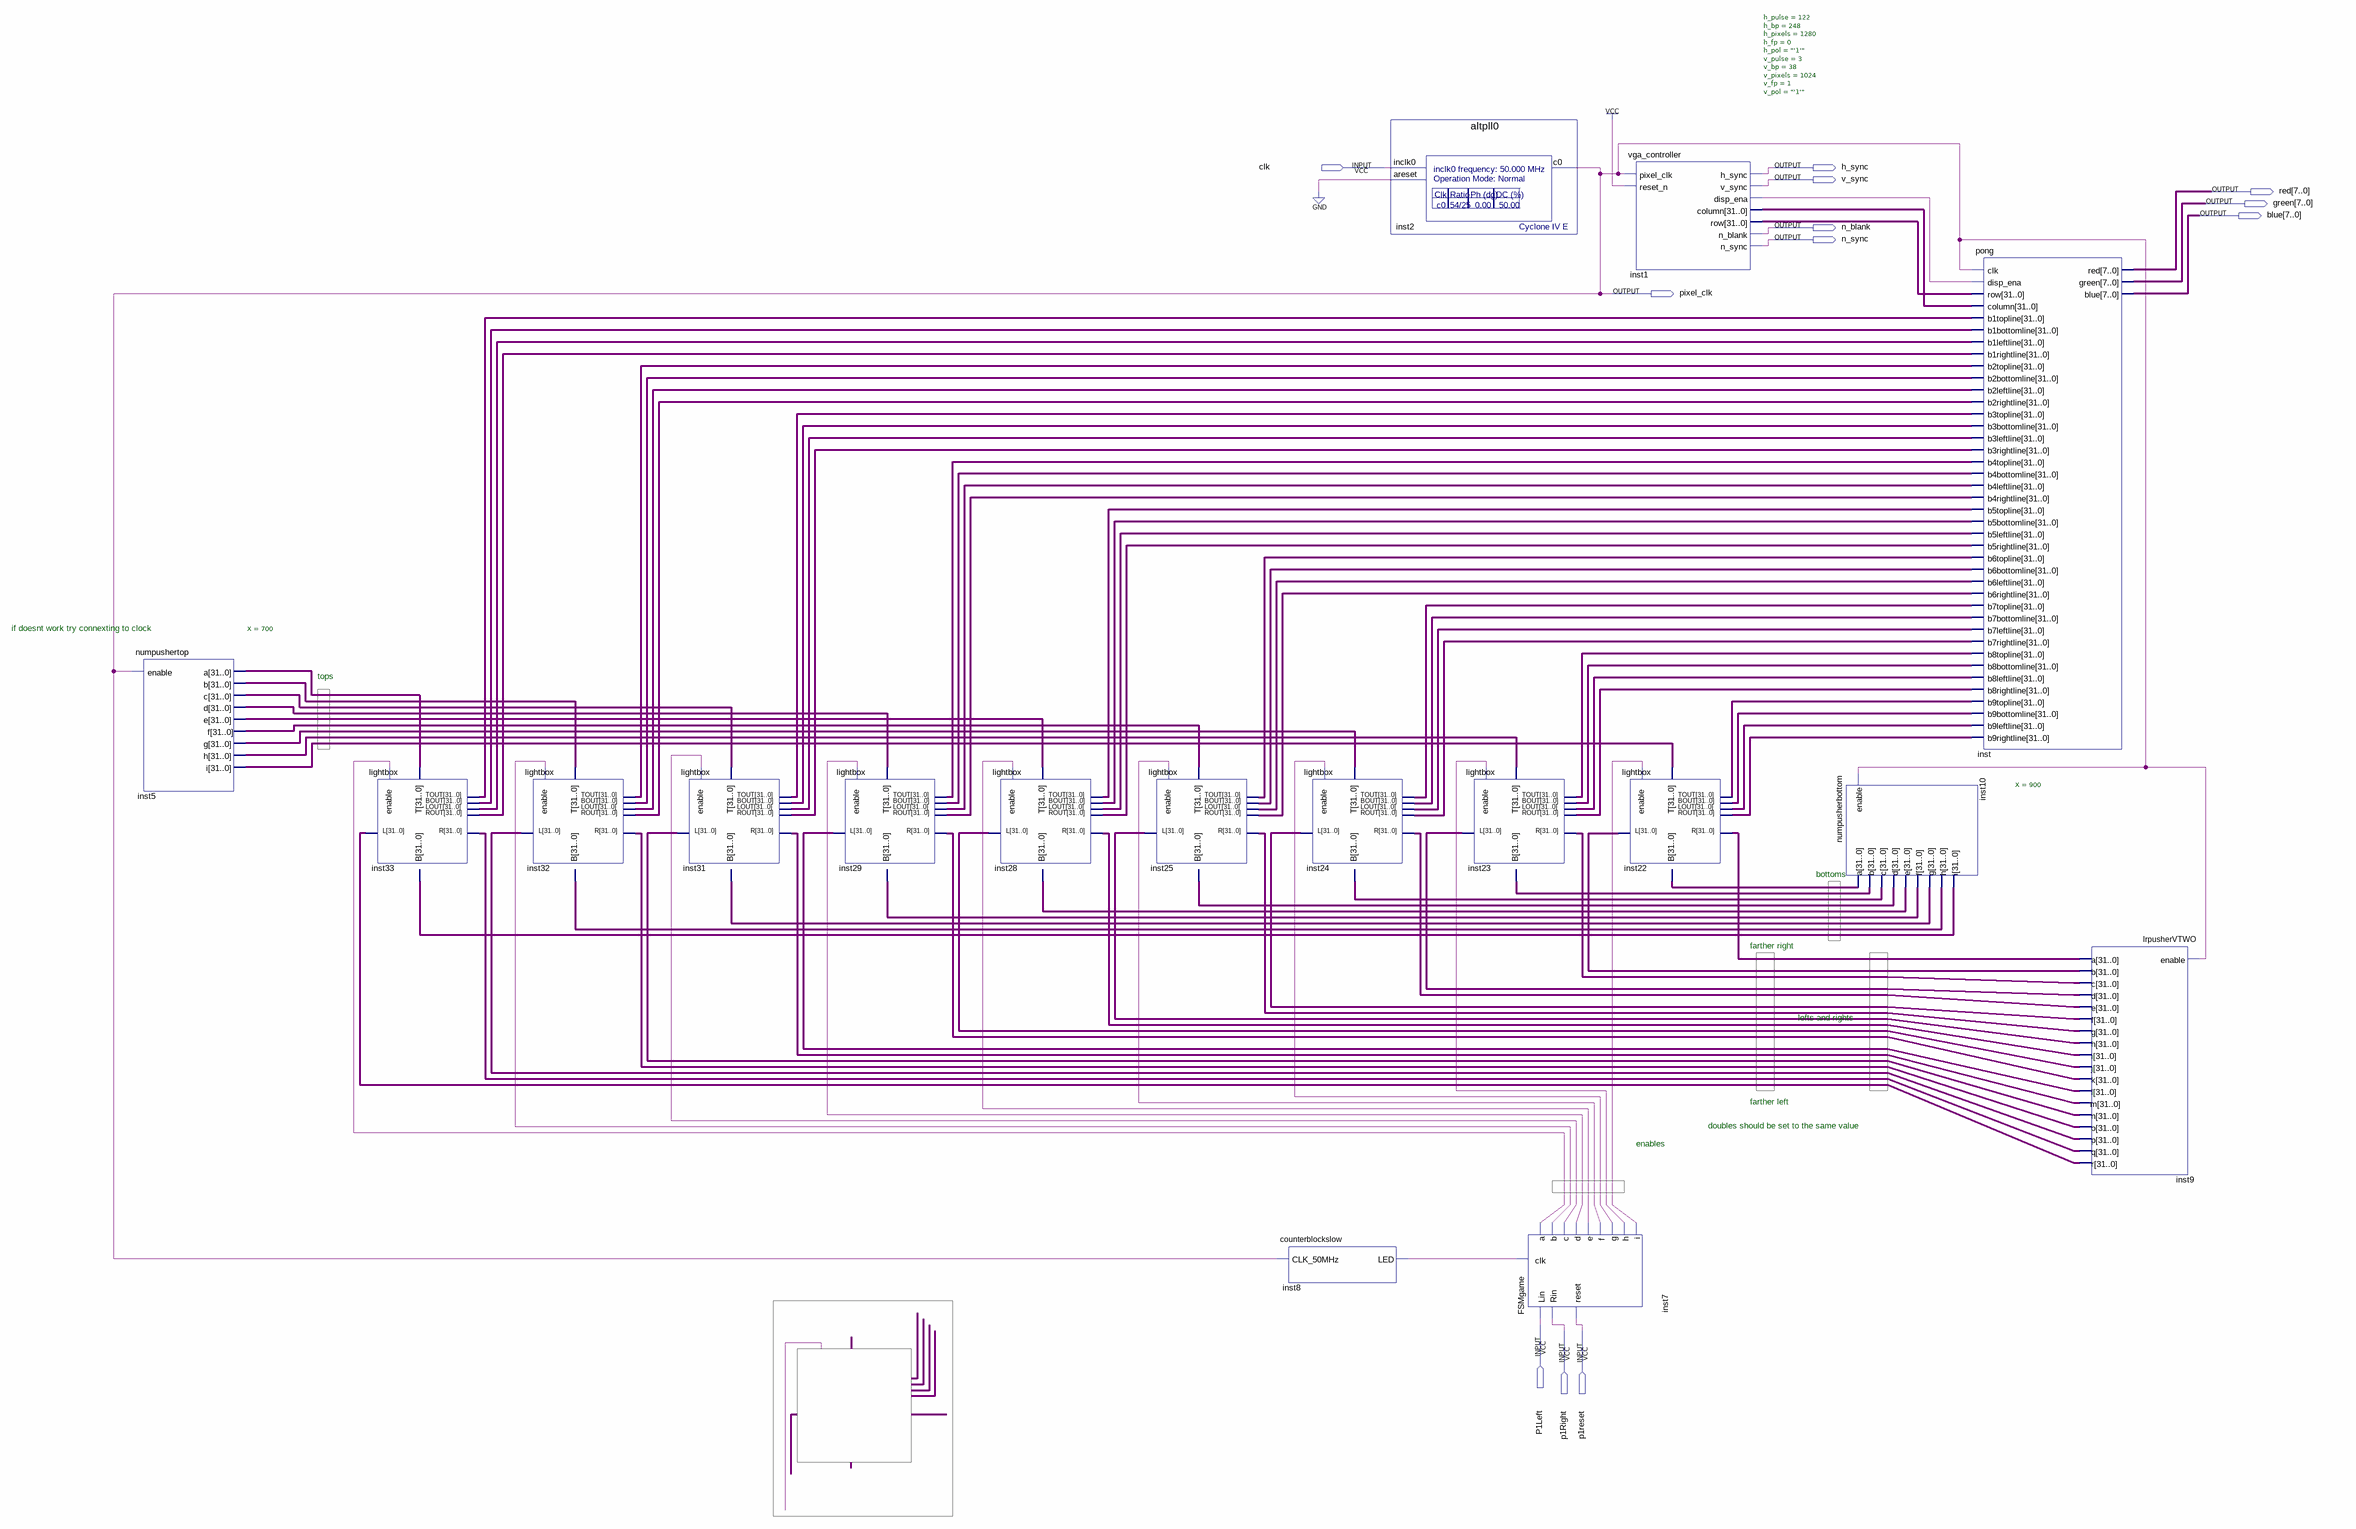
[diagram p0: schematic sheet]
// Quartus schematic vga_with_hw_test_image.bdf as structural Verilog: 17 symbols, 12 pins
module vga_with_hw_test_image (
  input  clk,
  input  P1Left,
  input  p1Right,
  input  p1reset,
  output h_sync,
  output v_sync,
  output [7:0] red,
  output [7:0] green,
  output [7:0] blue,
  output n_blank,
  output n_sync,
  output pixel_clk
);

  wire inst1_disp_ena, inst7_a, inst7_b, inst7_c, inst7_d, inst7_e, inst7_f, inst7_g, inst7_h, inst7_i,
       inst8_led;
  wire [31:0] inst1_column, inst1_row, inst5_a, inst5_b, inst5_c, inst5_d, inst5_e, inst5_f, inst5_g,
       inst5_h, inst5_i, inst9_a, inst9_b, inst9_c, inst9_d, inst9_e, inst9_f, inst9_g, inst9_h, inst9_i,
       inst9_j, inst9_k, inst9_l, inst9_m, inst9_n, inst9_o, inst9_p, inst9_q, inst9_r, inst10_a, inst10_b,
       inst10_c, inst10_d, inst10_e, inst10_f, inst10_g, inst10_h, inst10_i, inst22_bout, inst22_lout,
       inst22_rout, inst22_tout, inst23_bout, inst23_lout, inst23_rout, inst23_tout, inst24_bout,
       inst24_lout, inst24_rout, inst24_tout, inst25_bout, inst25_lout, inst25_rout, inst25_tout,
       inst28_bout, inst28_lout, inst28_rout, inst28_tout, inst29_bout, inst29_lout, inst29_rout,
       inst29_tout, inst31_bout, inst31_lout, inst31_rout, inst31_tout, inst32_bout, inst32_lout,
       inst32_rout, inst32_tout, inst33_bout, inst33_lout, inst33_rout, inst33_tout;

  numpushertop #(.X(700)) inst5 (
    .enable(pixel_clk), .a(inst5_a), .b(inst5_b), .c(inst5_c), .d(inst5_d), .e(inst5_e), .f(inst5_f),
    .g(inst5_g), .h(inst5_h), .i(inst5_i));
  lightbox inst33 (
    .enable(inst7_a), .T(inst5_a), .B(inst10_i), .L(inst9_r), .R(inst9_q), .TOUT(inst33_tout),
    .BOUT(inst33_bout), .LOUT(inst33_lout), .ROUT(inst33_rout));
  lightbox inst32 (
    .enable(inst7_b), .T(inst5_b), .B(inst10_h), .L(inst9_p), .R(inst9_o), .TOUT(inst32_tout),
    .BOUT(inst32_bout), .LOUT(inst32_lout), .ROUT(inst32_rout));
  lightbox inst31 (
    .enable(inst7_c), .T(inst5_c), .B(inst10_g), .L(inst9_n), .R(inst9_m), .TOUT(inst31_tout),
    .BOUT(inst31_bout), .LOUT(inst31_lout), .ROUT(inst31_rout));
  lightbox inst29 (
    .enable(inst7_d), .T(inst5_d), .B(inst10_f), .L(inst9_l), .R(inst9_k), .TOUT(inst29_tout),
    .BOUT(inst29_bout), .LOUT(inst29_lout), .ROUT(inst29_rout));
  lightbox inst28 (
    .enable(inst7_e), .T(inst5_e), .B(inst10_e), .L(inst9_j), .R(inst9_i), .TOUT(inst28_tout),
    .BOUT(inst28_bout), .LOUT(inst28_lout), .ROUT(inst28_rout));
  lightbox inst25 (
    .enable(inst7_f), .T(inst5_f), .B(inst10_d), .L(inst9_h), .R(inst9_g), .TOUT(inst25_tout),
    .BOUT(inst25_bout), .LOUT(inst25_lout), .ROUT(inst25_rout));
  counterblockslow inst8 (.CLK_50MHz(pixel_clk), .LED(inst8_led));
  lightbox inst24 (
    .enable(inst7_g), .T(inst5_g), .B(inst10_c), .L(inst9_f), .R(inst9_e), .TOUT(inst24_tout),
    .BOUT(inst24_bout), .LOUT(inst24_lout), .ROUT(inst24_rout));
  altpll0 inst2 (.inclk0(clk), .areset(1'b0), .c0(pixel_clk));
  lightbox inst23 (
    .enable(inst7_h), .T(inst5_h), .B(inst10_b), .L(inst9_d), .R(inst9_c), .TOUT(inst23_tout),
    .BOUT(inst23_bout), .LOUT(inst23_lout), .ROUT(inst23_rout));
  FSMgame inst7 (
    .Lin(P1Left), .Rin(p1Right), .clk(inst8_led), .reset(p1reset), .a(inst7_a), .b(inst7_b), .c(inst7_c),
    .d(inst7_d), .e(inst7_e), .f(inst7_f), .g(inst7_g), .h(inst7_h), .i(inst7_i));
  lightbox inst22 (
    .enable(inst7_i), .T(inst5_i), .B(inst10_a), .L(inst9_b), .R(inst9_a), .TOUT(inst22_tout),
    .BOUT(inst22_bout), .LOUT(inst22_lout), .ROUT(inst22_rout));
  vga_controller #(.h_pulse(122), .h_bp(248), .h_pixels(1280), .h_fp(0), .h_pol("'1'"), .v_pulse(3), .v_bp(38), .v_pixels(1024), .v_fp(1), .v_pol("'1'")) inst1 (
    .pixel_clk(pixel_clk), .reset_n(1'b1), .h_sync(h_sync), .v_sync(v_sync), .disp_ena(inst1_disp_ena),
    .column(inst1_column), .row(inst1_row), .n_blank(n_blank), .n_sync(n_sync));
  numpusherbottom #(.X(900)) inst10 (
    .enable(pixel_clk), .a(inst10_a), .b(inst10_b), .c(inst10_c), .d(inst10_d), .e(inst10_e), .f(inst10_f),
    .g(inst10_g), .h(inst10_h), .i(inst10_i));
  pong inst (
    .clk(pixel_clk), .disp_ena(inst1_disp_ena), .row(inst1_row), .column(inst1_column),
    .b1topline(inst33_tout), .b1bottomline(inst33_bout), .b1leftline(inst33_lout), .b1rightline(inst33_rout),
    .b2topline(inst32_tout), .b2bottomline(inst32_bout), .b2leftline(inst32_lout), .b2rightline(inst32_rout),
    .b3topline(inst31_tout), .b3bottomline(inst31_bout), .b3leftline(inst31_lout), .b3rightline(inst31_rout),
    .b4topline(inst29_tout), .b4bottomline(inst29_bout), .b4leftline(inst29_lout), .b4rightline(inst29_rout),
    .b5topline(inst28_tout), .b5bottomline(inst28_bout), .b5leftline(inst28_lout), .b5rightline(inst28_rout),
    .b6topline(inst25_tout), .b6bottomline(inst25_bout), .b6leftline(inst25_lout), .b6rightline(inst25_rout),
    .b7topline(inst24_tout), .b7bottomline(inst24_bout), .b7leftline(inst24_lout), .b7rightline(inst24_rout),
    .b8topline(inst23_tout), .b8bottomline(inst23_bout), .b8leftline(inst23_lout), .b8rightline(inst23_rout),
    .b9topline(inst22_tout), .b9bottomline(inst22_bout), .b9leftline(inst22_lout), .b9rightline(inst22_rout),
    .red(red), .green(green), .blue(blue));
  lrpusherVTWO inst9 (
    .enable(pixel_clk), .a(inst9_a), .b(inst9_b), .c(inst9_c), .d(inst9_d), .e(inst9_e), .f(inst9_f),
    .g(inst9_g), .h(inst9_h), .i(inst9_i), .j(inst9_j), .k(inst9_k), .l(inst9_l), .m(inst9_m), .n(inst9_n),
    .o(inst9_o), .p(inst9_p), .q(inst9_q), .r(inst9_r));

  // Notes on the sheet:
  //   if doesnt work try connexting to clock
  //   tops
  //   bottoms
  //   farther right
  //   lefts and rights
  //   farther left
  //   doubles should be set to the same value
  //   enables
endmodule
